# EAGLE schematic mpiovd (EAGLE 6.1), part 2 of 2
## Sheet 7 of 11: rel3
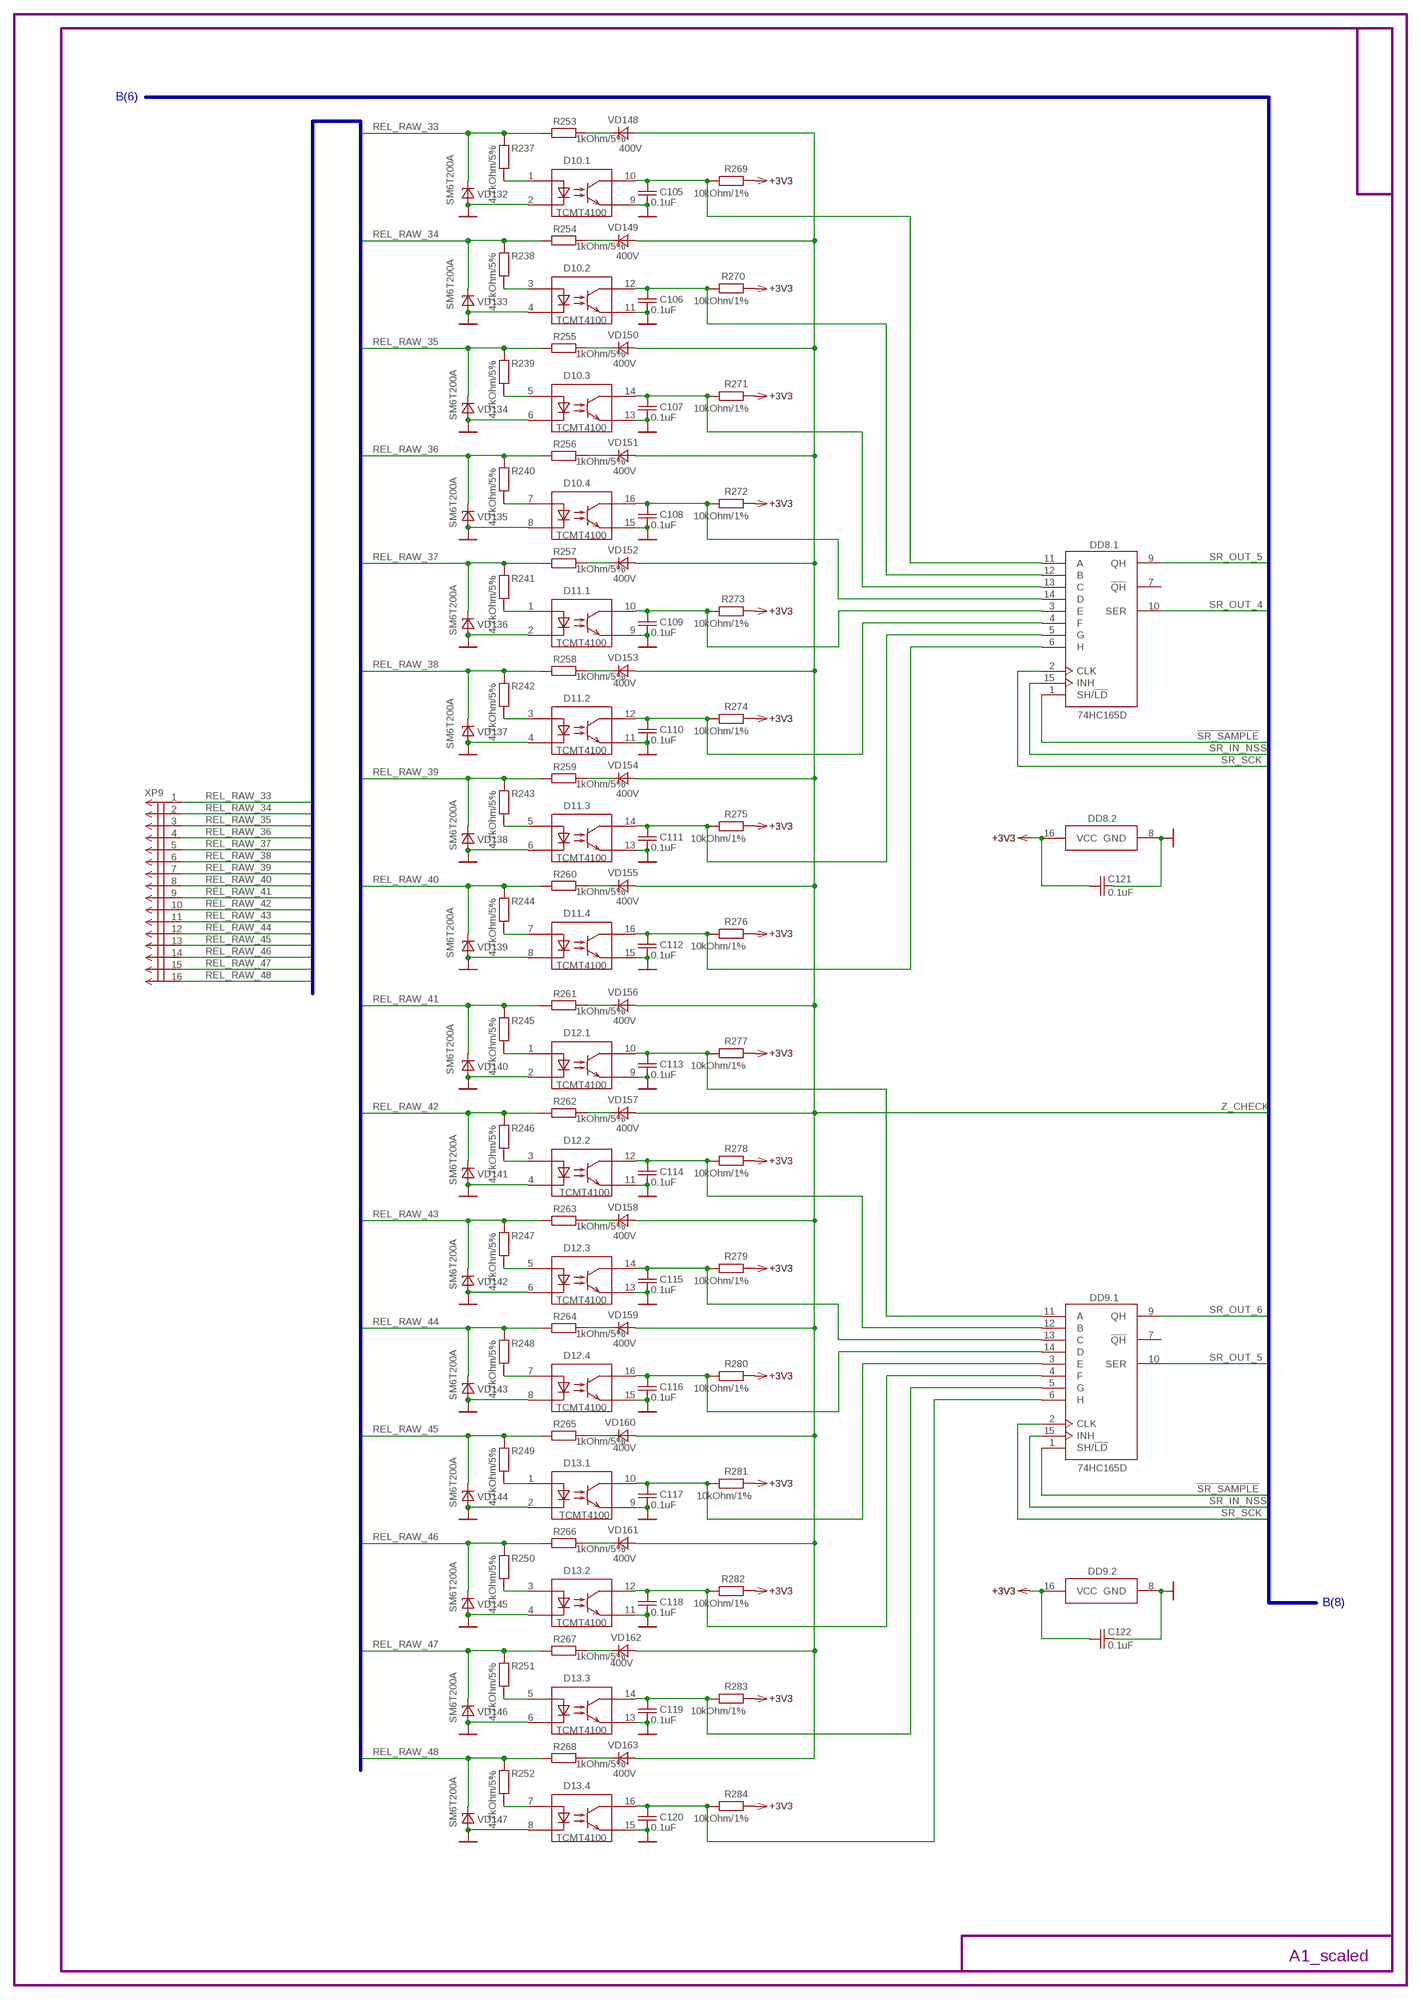
[diagram p6: schematic, sheet 7]

### Parts
C105  0.1uF  C-EUC0603  [C0603]
C106  0.1uF  C-EUC0603  [C0603]
C107  0.1uF  C-EUC0603  [C0603]
C108  0.1uF  C-EUC0603  [C0603]
C109  0.1uF  C-EUC0603  [C0603]
C110  0.1uF  C-EUC0603  [C0603]
C111  0.1uF  C-EUC0603  [C0603]
C112  0.1uF  C-EUC0603  [C0603]
C113  0.1uF  C-EUC0603  [C0603]
C114  0.1uF  C-EUC0603  [C0603]
C115  0.1uF  C-EUC0603  [C0603]
C116  0.1uF  C-EUC0603  [C0603]
C117  0.1uF  C-EUC0603  [C0603]
C118  0.1uF  C-EUC0603  [C0603]
C119  0.1uF  C-EUC0603  [C0603]
C120  0.1uF  C-EUC0603  [C0603]
C121  0.1uF  C-EUC0603  [C0603]
C122  0.1uF  C-EUC0603  [C0603]
D10  TCMT4100  [SO16]
D11  TCMT4100  [SO16]
D12  TCMT4100  [SO16]
D13  TCMT4100  [SO16]
DD8  74HC165D  [SO16]
DD9  74HC165D  [SO16]
R237  4.7kOhm/5%  R-EU_R1206  [R1206]
R238  4.7kOhm/5%  R-EU_R1206  [R1206]
R239  4.7kOhm/5%  R-EU_R1206  [R1206]
R240  4.7kOhm/5%  R-EU_R1206  [R1206]
R241  4.7kOhm/5%  R-EU_R1206  [R1206]
R242  4.7kOhm/5%  R-EU_R1206  [R1206]
R243  4.7kOhm/5%  R-EU_R1206  [R1206]
R244  4.7kOhm/5%  R-EU_R1206  [R1206]
R245  4.7kOhm/5%  R-EU_R1206  [R1206]
R246  4.7kOhm/5%  R-EU_R1206  [R1206]
R247  4.7kOhm/5%  R-EU_R1206  [R1206]
R248  4.7kOhm/5%  R-EU_R1206  [R1206]
R249  4.7kOhm/5%  R-EU_R1206  [R1206]
R250  4.7kOhm/5%  R-EU_R1206  [R1206]
R251  4.7kOhm/5%  R-EU_R1206  [R1206]
R252  4.7kOhm/5%  R-EU_R1206  [R1206]
R253  1kOhm/5%  R-EU_R2512  [R2512]
R254  1kOhm/5%  R-EU_R2512  [R2512]
R255  1kOhm/5%  R-EU_R2512  [R2512]
R256  1kOhm/5%  R-EU_R2512  [R2512]
R257  1kOhm/5%  R-EU_R2512  [R2512]
R258  1kOhm/5%  R-EU_R2512  [R2512]
R259  1kOhm/5%  R-EU_R2512  [R2512]
R260  1kOhm/5%  R-EU_R2512  [R2512]
R261  1kOhm/5%  R-EU_R2512  [R2512]
R262  1kOhm/5%  R-EU_R2512  [R2512]
R263  1kOhm/5%  R-EU_R2512  [R2512]
R264  1kOhm/5%  R-EU_R2512  [R2512]
R265  1kOhm/5%  R-EU_R2512  [R2512]
R266  1kOhm/5%  R-EU_R2512  [R2512]
R267  1kOhm/5%  R-EU_R2512  [R2512]
R268  1kOhm/5%  R-EU_R2512  [R2512]
R269  10kOhm/1%  R-EU_R0603  [R0603]
R270  10kOhm/1%  R-EU_R0603  [R0603]
R271  10kOhm/1%  R-EU_R0603  [R0603]
R272  10kOhm/1%  R-EU_R0603  [R0603]
R273  10kOhm/1%  R-EU_R0603  [R0603]
R274  10kOhm/1%  R-EU_R0603  [R0603]
R275  10kOhm/1%  R-EU_R0603  [R0603]
R276  10kOhm/1%  R-EU_R0603  [R0603]
R277  10kOhm/1%  R-EU_R0603  [R0603]
R278  10kOhm/1%  R-EU_R0603  [R0603]
R279  10kOhm/1%  R-EU_R0603  [R0603]
R280  10kOhm/1%  R-EU_R0603  [R0603]
R281  10kOhm/1%  R-EU_R0603  [R0603]
R282  10kOhm/1%  R-EU_R0603  [R0603]
R283  10kOhm/1%  R-EU_R0603  [R0603]
R284  10kOhm/1%  R-EU_R0603  [R0603]
VD132  SM6T200A  DIODE-TVS-UNIDIR-SMB  [SMB]
VD133  SM6T200A  DIODE-TVS-UNIDIR-SMB  [SMB]
VD134  SM6T200A  DIODE-TVS-UNIDIR-SMB  [SMB]
VD135  SM6T200A  DIODE-TVS-UNIDIR-SMB  [SMB]
VD136  SM6T200A  DIODE-TVS-UNIDIR-SMB  [SMB]
VD137  SM6T200A  DIODE-TVS-UNIDIR-SMB  [SMB]
VD138  SM6T200A  DIODE-TVS-UNIDIR-SMB  [SMB]
VD139  SM6T200A  DIODE-TVS-UNIDIR-SMB  [SMB]
VD140  SM6T200A  DIODE-TVS-UNIDIR-SMB  [SMB]
VD141  SM6T200A  DIODE-TVS-UNIDIR-SMB  [SMB]
VD142  SM6T200A  DIODE-TVS-UNIDIR-SMB  [SMB]
VD143  SM6T200A  DIODE-TVS-UNIDIR-SMB  [SMB]
VD144  SM6T200A  DIODE-TVS-UNIDIR-SMB  [SMB]
VD145  SM6T200A  DIODE-TVS-UNIDIR-SMB  [SMB]
VD146  SM6T200A  DIODE-TVS-UNIDIR-SMB  [SMB]
VD147  SM6T200A  DIODE-TVS-UNIDIR-SMB  [SMB]
VD148  400V  DIODE-STANDARD-SMA  [SMA]
VD149  400V  DIODE-STANDARD-SMA  [SMA]
VD150  400V  DIODE-STANDARD-SMA  [SMA]
VD151  400V  DIODE-STANDARD-SMA  [SMA]
VD152  400V  DIODE-STANDARD-SMA  [SMA]
VD153  400V  DIODE-STANDARD-SMA  [SMA]
VD154  400V  DIODE-STANDARD-SMA  [SMA]
VD155  400V  DIODE-STANDARD-SMA  [SMA]
VD156  400V  DIODE-STANDARD-SMA  [SMA]
VD157  400V  DIODE-STANDARD-SMA  [SMA]
VD158  400V  DIODE-STANDARD-SMA  [SMA]
VD159  400V  DIODE-STANDARD-SMA  [SMA]
VD160  400V  DIODE-STANDARD-SMA  [SMA]
VD161  400V  DIODE-STANDARD-SMA  [SMA]
VD162  400V  DIODE-STANDARD-SMA  [SMA]
VD163  400V  DIODE-STANDARD-SMA  [SMA]
XP9  MOLEX-90130-16  [MOLEX-90130-16]

### Nets
!SR_SAMPLE: DD8.1(.1:SH/!LD) DD9.1(.1:SH/!LD) ; also sheet 1,5,6,8
+3V3: C121.1 C122.1 DD8.16(.2:VCC) DD9.16(.2:VCC) R269.1 R270.1 R271.1 R272.1 R273.1 R274.1 R275.1 R276.1 R277.1 R278.1 R279.1 R280.1 R281.1 R282.1 R283.1 R284.1 ; also sheet 1,4,5,6,8,9,10
DISCRETE_33: C105.1 D10.10(.1:TC) DD8.11(.1:A) R269.2
DISCRETE_34: C106.1 D10.12(.2:TC) DD8.12(.1:B) R270.2
DISCRETE_35: C107.1 D10.14(.3:TC) DD8.13(.1:C) R271.2
DISCRETE_36: C108.1 D10.16(.4:TC) DD8.14(.1:D) R272.2
DISCRETE_37: C109.1 D11.10(.1:TC) DD8.3(.1:E) R273.2
DISCRETE_38: C110.1 D11.12(.2:TC) DD8.4(.1:F) R274.2
DISCRETE_39: C111.1 D11.14(.3:TC) DD8.5(.1:G) R275.2
DISCRETE_40: C112.1 D11.16(.4:TC) DD8.6(.1:H) R276.2
DISCRETE_41: C113.1 D12.10(.1:TC) DD9.11(.1:A) R277.2
DISCRETE_42: C114.1 D12.12(.2:TC) DD9.12(.1:B) R278.2
DISCRETE_43: C115.1 D12.14(.3:TC) DD9.13(.1:C) R279.2
DISCRETE_44: C116.1 D12.16(.4:TC) DD9.14(.1:D) R280.2
DISCRETE_45: C117.1 D13.10(.1:TC) DD9.3(.1:E) R281.2
DISCRETE_46: C118.1 D13.12(.2:TC) DD9.4(.1:F) R282.2
DISCRETE_47: C119.1 D13.14(.3:TC) DD9.5(.1:G) R283.2
DISCRETE_48: C120.1 D13.16(.4:TC) DD9.6(.1:H) R284.2
GND: C105.2 C106.2 C107.2 C108.2 C109.2 C110.2 C111.2 C112.2 C113.2 C114.2 C115.2 C116.2 C117.2 C118.2 C119.2 C120.2 C121.2 C122.2 D10.2(.1:DC) D10.4(.2:DC) D10.6(.3:DC) D10.8(.4:DC) D10.9(.1:TE) D10.11(.2:TE) D10.13(.3:TE) D10.15(.4:TE) D11.2(.1:DC) D11.4(.2:DC) D11.6(.3:DC) D11.8(.4:DC) D11.9(.1:TE) D11.11(.2:TE) D11.13(.3:TE) D11.15(.4:TE) D12.2(.1:DC) D12.4(.2:DC) D12.6(.3:DC) D12.8(.4:DC) D12.9(.1:TE) D12.11(.2:TE) D12.13(.3:TE) D12.15(.4:TE) D13.2(.1:DC) D13.4(.2:DC) D13.6(.3:DC) D13.8(.4:DC) D13.9(.1:TE) D13.11(.2:TE) D13.13(.3:TE) D13.15(.4:TE) DD8.8(.2:GND) DD9.8(.2:GND) VD132.A VD133.A VD134.A VD135.A VD136.A VD137.A VD138.A VD139.A VD140.A VD141.A VD142.A VD143.A VD144.A VD145.A VD146.A VD147.A ; also sheet 1,2,3,4,5,6,8,9,10
N$91: D10.1(.1:DA) R237.2
N$93: D10.3(.2:DA) R238.2
N$94: D10.5(.3:DA) R239.2
N$95: D10.7(.4:DA) R240.2
N$96: R253.2 VD148.C
N$97: D11.1(.1:DA) R241.2
N$98: D11.3(.2:DA) R242.2
N$99: D11.5(.3:DA) R243.2
N$100: D11.7(.4:DA) R244.2
N$101: D12.1(.1:DA) R245.2
N$102: D12.3(.2:DA) R246.2
N$103: D12.5(.3:DA) R247.2
N$104: D12.7(.4:DA) R248.2
N$105: D13.1(.1:DA) R249.2
N$106: D13.3(.2:DA) R250.2
N$107: D13.5(.3:DA) R251.2
N$108: D13.7(.4:DA) R252.2
N$109: R254.2 VD149.C
N$111: R255.2 VD150.C
N$113: R256.2 VD151.C
N$115: R257.2 VD152.C
N$117: R258.2 VD153.C
N$119: R259.2 VD154.C
N$121: R260.2 VD155.C
N$123: R261.2 VD156.C
N$125: R262.2 VD157.C
N$127: R263.2 VD158.C
N$129: R264.2 VD159.C
N$131: R265.2 VD160.C
N$133: R266.2 VD161.C
N$135: R267.2 VD162.C
N$137: R268.2 VD163.C
REL_RAW_33: R237.1 R253.1 VD132.C XP9.1
REL_RAW_34: R238.1 R254.1 VD133.C XP9.2
REL_RAW_35: R239.1 R255.1 VD134.C XP9.3
REL_RAW_36: R240.1 R256.1 VD135.C XP9.4
REL_RAW_37: R241.1 R257.1 VD136.C XP9.5
REL_RAW_38: R242.1 R258.1 VD137.C XP9.6
REL_RAW_39: R243.1 R259.1 VD138.C XP9.7
REL_RAW_40: R244.1 R260.1 VD139.C XP9.8
REL_RAW_41: R245.1 R261.1 VD140.C XP9.9
REL_RAW_42: R246.1 R262.1 VD141.C XP9.10
REL_RAW_43: R247.1 R263.1 VD142.C XP9.11
REL_RAW_44: R248.1 R264.1 VD143.C XP9.12
REL_RAW_45: R249.1 R265.1 VD144.C XP9.13
REL_RAW_46: R250.1 R266.1 VD145.C XP9.14
REL_RAW_47: R251.1 R267.1 VD146.C XP9.15
REL_RAW_48: R252.1 R268.1 VD147.C XP9.16
SR_IN_NSS: DD8.15(.1:INH) DD9.15(.1:INH) ; also sheet 1,5,6,8
SR_OUT_4: DD8.10(.1:SER) ; also sheet 6
SR_OUT_5: DD8.9(.1:QH) DD9.10(.1:SER)
SR_OUT_6: DD9.9(.1:QH) ; also sheet 8
SR_SCK: DD8.2(.1:CLK) DD9.2(.1:CLK) ; also sheet 1,5,6,8,9
Z_CHECK: VD148.A VD149.A VD150.A VD151.A VD152.A VD153.A VD154.A VD155.A VD156.A VD157.A VD158.A VD159.A VD160.A VD161.A VD162.A VD163.A ; also sheet 5,6,8
Unconnected: DD8.7(.1:!QH) DD9.7(.1:!QH)

### Buses
IO_EXPAND:SR_MISO,SR_MOSI,SR_SCK,!SR_SAMPLE,SR_IN_NSS,SR_OUT_NSS,!SR_OUT_ENABLE,SR_OUT_[1..7],Z_CHECK_TOGGLE,Z_CHECK
REL_RAW_[1..64]

### Notes on the sheet
- B(6)
- B(8)

## Sheet 8 of 11: rel4
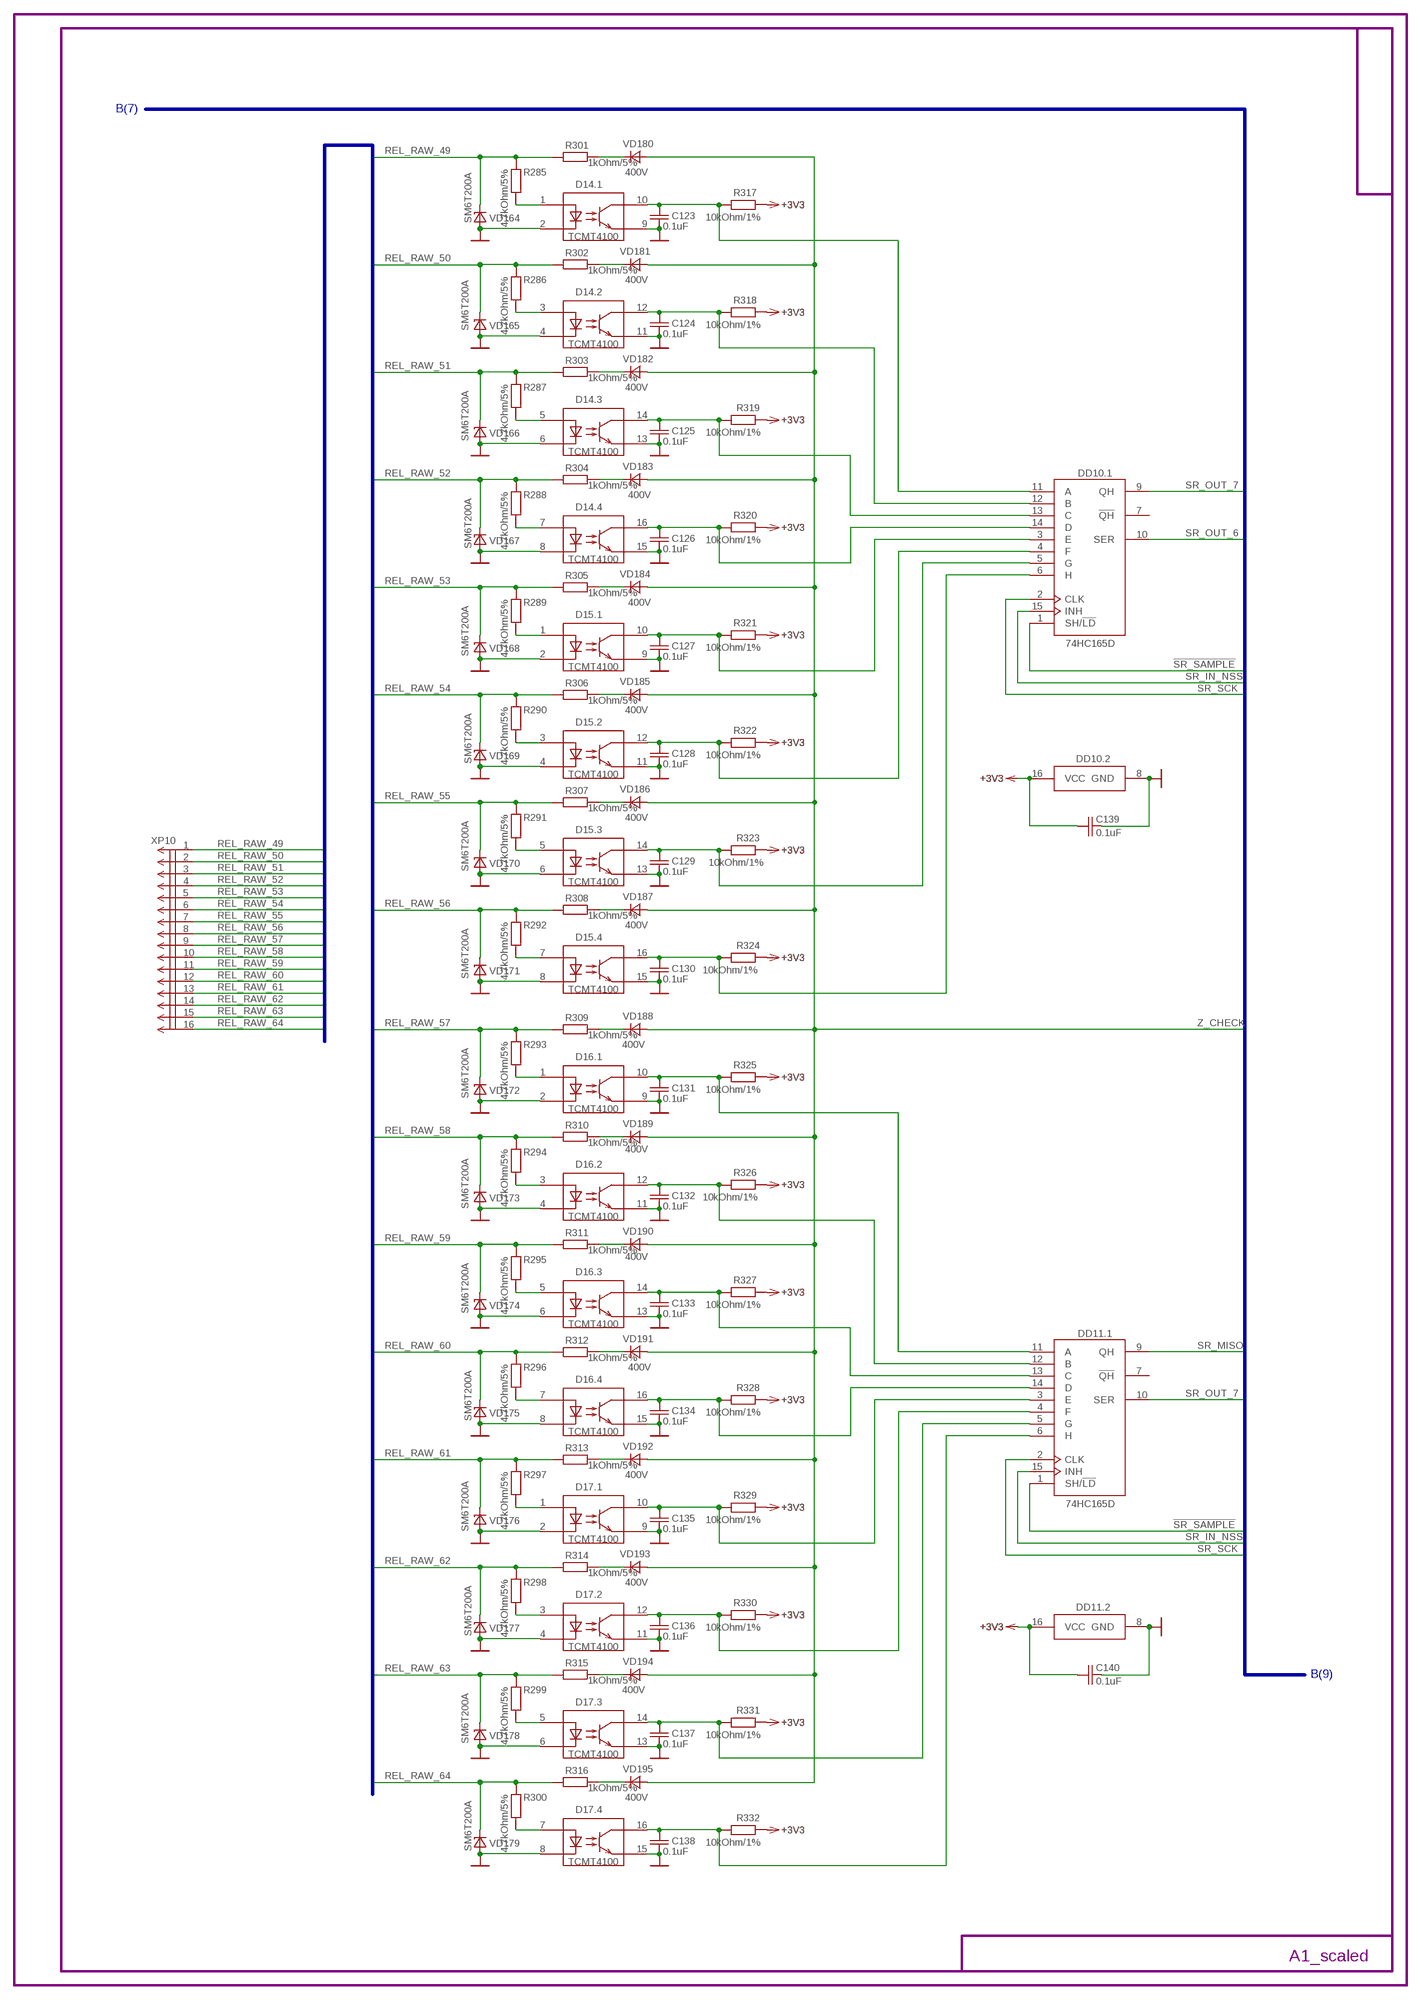
[diagram p7: schematic, sheet 8]

### Parts
C123  0.1uF  C-EUC0603  [C0603]
C124  0.1uF  C-EUC0603  [C0603]
C125  0.1uF  C-EUC0603  [C0603]
C126  0.1uF  C-EUC0603  [C0603]
C127  0.1uF  C-EUC0603  [C0603]
C128  0.1uF  C-EUC0603  [C0603]
C129  0.1uF  C-EUC0603  [C0603]
C130  0.1uF  C-EUC0603  [C0603]
C131  0.1uF  C-EUC0603  [C0603]
C132  0.1uF  C-EUC0603  [C0603]
C133  0.1uF  C-EUC0603  [C0603]
C134  0.1uF  C-EUC0603  [C0603]
C135  0.1uF  C-EUC0603  [C0603]
C136  0.1uF  C-EUC0603  [C0603]
C137  0.1uF  C-EUC0603  [C0603]
C138  0.1uF  C-EUC0603  [C0603]
C139  0.1uF  C-EUC0603  [C0603]
C140  0.1uF  C-EUC0603  [C0603]
D14  TCMT4100  [SO16]
D15  TCMT4100  [SO16]
D16  TCMT4100  [SO16]
D17  TCMT4100  [SO16]
DD10  74HC165D  [SO16]
DD11  74HC165D  [SO16]
R285  4.7kOhm/5%  R-EU_R1206  [R1206]
R286  4.7kOhm/5%  R-EU_R1206  [R1206]
R287  4.7kOhm/5%  R-EU_R1206  [R1206]
R288  4.7kOhm/5%  R-EU_R1206  [R1206]
R289  4.7kOhm/5%  R-EU_R1206  [R1206]
R290  4.7kOhm/5%  R-EU_R1206  [R1206]
R291  4.7kOhm/5%  R-EU_R1206  [R1206]
R292  4.7kOhm/5%  R-EU_R1206  [R1206]
R293  4.7kOhm/5%  R-EU_R1206  [R1206]
R294  4.7kOhm/5%  R-EU_R1206  [R1206]
R295  4.7kOhm/5%  R-EU_R1206  [R1206]
R296  4.7kOhm/5%  R-EU_R1206  [R1206]
R297  4.7kOhm/5%  R-EU_R1206  [R1206]
R298  4.7kOhm/5%  R-EU_R1206  [R1206]
R299  4.7kOhm/5%  R-EU_R1206  [R1206]
R300  4.7kOhm/5%  R-EU_R1206  [R1206]
R301  1kOhm/5%  R-EU_R2512  [R2512]
R302  1kOhm/5%  R-EU_R2512  [R2512]
R303  1kOhm/5%  R-EU_R2512  [R2512]
R304  1kOhm/5%  R-EU_R2512  [R2512]
R305  1kOhm/5%  R-EU_R2512  [R2512]
R306  1kOhm/5%  R-EU_R2512  [R2512]
R307  1kOhm/5%  R-EU_R2512  [R2512]
R308  1kOhm/5%  R-EU_R2512  [R2512]
R309  1kOhm/5%  R-EU_R2512  [R2512]
R310  1kOhm/5%  R-EU_R2512  [R2512]
R311  1kOhm/5%  R-EU_R2512  [R2512]
R312  1kOhm/5%  R-EU_R2512  [R2512]
R313  1kOhm/5%  R-EU_R2512  [R2512]
R314  1kOhm/5%  R-EU_R2512  [R2512]
R315  1kOhm/5%  R-EU_R2512  [R2512]
R316  1kOhm/5%  R-EU_R2512  [R2512]
R317  10kOhm/1%  R-EU_R0603  [R0603]
R318  10kOhm/1%  R-EU_R0603  [R0603]
R319  10kOhm/1%  R-EU_R0603  [R0603]
R320  10kOhm/1%  R-EU_R0603  [R0603]
R321  10kOhm/1%  R-EU_R0603  [R0603]
R322  10kOhm/1%  R-EU_R0603  [R0603]
R323  10kOhm/1%  R-EU_R0603  [R0603]
R324  10kOhm/1%  R-EU_R0603  [R0603]
R325  10kOhm/1%  R-EU_R0603  [R0603]
R326  10kOhm/1%  R-EU_R0603  [R0603]
R327  10kOhm/1%  R-EU_R0603  [R0603]
R328  10kOhm/1%  R-EU_R0603  [R0603]
R329  10kOhm/1%  R-EU_R0603  [R0603]
R330  10kOhm/1%  R-EU_R0603  [R0603]
R331  10kOhm/1%  R-EU_R0603  [R0603]
R332  10kOhm/1%  R-EU_R0603  [R0603]
VD164  SM6T200A  DIODE-TVS-UNIDIR-SMB  [SMB]
VD165  SM6T200A  DIODE-TVS-UNIDIR-SMB  [SMB]
VD166  SM6T200A  DIODE-TVS-UNIDIR-SMB  [SMB]
VD167  SM6T200A  DIODE-TVS-UNIDIR-SMB  [SMB]
VD168  SM6T200A  DIODE-TVS-UNIDIR-SMB  [SMB]
VD169  SM6T200A  DIODE-TVS-UNIDIR-SMB  [SMB]
VD170  SM6T200A  DIODE-TVS-UNIDIR-SMB  [SMB]
VD171  SM6T200A  DIODE-TVS-UNIDIR-SMB  [SMB]
VD172  SM6T200A  DIODE-TVS-UNIDIR-SMB  [SMB]
VD173  SM6T200A  DIODE-TVS-UNIDIR-SMB  [SMB]
VD174  SM6T200A  DIODE-TVS-UNIDIR-SMB  [SMB]
VD175  SM6T200A  DIODE-TVS-UNIDIR-SMB  [SMB]
VD176  SM6T200A  DIODE-TVS-UNIDIR-SMB  [SMB]
VD177  SM6T200A  DIODE-TVS-UNIDIR-SMB  [SMB]
VD178  SM6T200A  DIODE-TVS-UNIDIR-SMB  [SMB]
VD179  SM6T200A  DIODE-TVS-UNIDIR-SMB  [SMB]
VD180  400V  DIODE-STANDARD-SMA  [SMA]
VD181  400V  DIODE-STANDARD-SMA  [SMA]
VD182  400V  DIODE-STANDARD-SMA  [SMA]
VD183  400V  DIODE-STANDARD-SMA  [SMA]
VD184  400V  DIODE-STANDARD-SMA  [SMA]
VD185  400V  DIODE-STANDARD-SMA  [SMA]
VD186  400V  DIODE-STANDARD-SMA  [SMA]
VD187  400V  DIODE-STANDARD-SMA  [SMA]
VD188  400V  DIODE-STANDARD-SMA  [SMA]
VD189  400V  DIODE-STANDARD-SMA  [SMA]
VD190  400V  DIODE-STANDARD-SMA  [SMA]
VD191  400V  DIODE-STANDARD-SMA  [SMA]
VD192  400V  DIODE-STANDARD-SMA  [SMA]
VD193  400V  DIODE-STANDARD-SMA  [SMA]
VD194  400V  DIODE-STANDARD-SMA  [SMA]
VD195  400V  DIODE-STANDARD-SMA  [SMA]
XP10  MOLEX-90130-16  [MOLEX-90130-16]

### Nets
!SR_SAMPLE: DD10.1(.1:SH/!LD) DD11.1(.1:SH/!LD) ; also sheet 1,5,6,7
+3V3: C139.1 C140.1 DD10.16(.2:VCC) DD11.16(.2:VCC) R317.1 R318.1 R319.1 R320.1 R321.1 R322.1 R323.1 R324.1 R325.1 R326.1 R327.1 R328.1 R329.1 R330.1 R331.1 R332.1 ; also sheet 1,4,5,6,7,9,10
DISCRETE_49: C123.1 D14.10(.1:TC) DD10.11(.1:A) R317.2
DISCRETE_50: C124.1 D14.12(.2:TC) DD10.12(.1:B) R318.2
DISCRETE_51: C125.1 D14.14(.3:TC) DD10.13(.1:C) R319.2
DISCRETE_52: C126.1 D14.16(.4:TC) DD10.14(.1:D) R320.2
DISCRETE_53: C127.1 D15.10(.1:TC) DD10.3(.1:E) R321.2
DISCRETE_54: C128.1 D15.12(.2:TC) DD10.4(.1:F) R322.2
DISCRETE_55: C129.1 D15.14(.3:TC) DD10.5(.1:G) R323.2
DISCRETE_56: C130.1 D15.16(.4:TC) DD10.6(.1:H) R324.2
DISCRETE_57: C131.1 D16.10(.1:TC) DD11.11(.1:A) R325.2
DISCRETE_58: C132.1 D16.12(.2:TC) DD11.12(.1:B) R326.2
DISCRETE_59: C133.1 D16.14(.3:TC) DD11.13(.1:C) R327.2
DISCRETE_60: C134.1 D16.16(.4:TC) DD11.14(.1:D) R328.2
DISCRETE_61: C135.1 D17.10(.1:TC) DD11.3(.1:E) R329.2
DISCRETE_62: C136.1 D17.12(.2:TC) DD11.4(.1:F) R330.2
DISCRETE_63: C137.1 D17.14(.3:TC) DD11.5(.1:G) R331.2
DISCRETE_64: C138.1 D17.16(.4:TC) DD11.6(.1:H) R332.2
GND: C123.2 C124.2 C125.2 C126.2 C127.2 C128.2 C129.2 C130.2 C131.2 C132.2 C133.2 C134.2 C135.2 C136.2 C137.2 C138.2 C139.2 C140.2 D14.2(.1:DC) D14.4(.2:DC) D14.6(.3:DC) D14.8(.4:DC) D14.9(.1:TE) D14.11(.2:TE) D14.13(.3:TE) D14.15(.4:TE) D15.2(.1:DC) D15.4(.2:DC) D15.6(.3:DC) D15.8(.4:DC) D15.9(.1:TE) D15.11(.2:TE) D15.13(.3:TE) D15.15(.4:TE) D16.2(.1:DC) D16.4(.2:DC) D16.6(.3:DC) D16.8(.4:DC) D16.9(.1:TE) D16.11(.2:TE) D16.13(.3:TE) D16.15(.4:TE) D17.2(.1:DC) D17.4(.2:DC) D17.6(.3:DC) D17.8(.4:DC) D17.9(.1:TE) D17.11(.2:TE) D17.13(.3:TE) D17.15(.4:TE) DD10.8(.2:GND) DD11.8(.2:GND) VD164.A VD165.A VD166.A VD167.A VD168.A VD169.A VD170.A VD171.A VD172.A VD173.A VD174.A VD175.A VD176.A VD177.A VD178.A VD179.A ; also sheet 1,2,3,4,5,6,7,9,10
N$110: R301.2 VD180.C
N$112: R302.2 VD181.C
N$114: R303.2 VD182.C
N$116: R304.2 VD183.C
N$118: R305.2 VD184.C
N$120: R306.2 VD185.C
N$122: R307.2 VD186.C
N$124: R308.2 VD187.C
N$126: R309.2 VD188.C
N$128: R310.2 VD189.C
N$130: R311.2 VD190.C
N$132: R312.2 VD191.C
N$134: R313.2 VD192.C
N$136: R314.2 VD193.C
N$138: R315.2 VD194.C
N$139: R316.2 VD195.C
N$140: D14.1(.1:DA) R285.2
N$141: D14.3(.2:DA) R286.2
N$142: D14.5(.3:DA) R287.2
N$143: D14.7(.4:DA) R288.2
N$144: D15.1(.1:DA) R289.2
N$145: D15.3(.2:DA) R290.2
N$146: D15.5(.3:DA) R291.2
N$147: D15.7(.4:DA) R292.2
N$148: D16.1(.1:DA) R293.2
N$149: D16.3(.2:DA) R294.2
N$150: D16.5(.3:DA) R295.2
N$151: D16.7(.4:DA) R296.2
N$152: D17.1(.1:DA) R297.2
N$153: D17.3(.2:DA) R298.2
N$154: D17.5(.3:DA) R299.2
N$155: D17.7(.4:DA) R300.2
REL_RAW_49: R285.1 R301.1 VD164.C XP10.1
REL_RAW_50: R286.1 R302.1 VD165.C XP10.2
REL_RAW_51: R287.1 R303.1 VD166.C XP10.3
REL_RAW_52: R288.1 R304.1 VD167.C XP10.4
REL_RAW_53: R289.1 R305.1 VD168.C XP10.5
REL_RAW_54: R290.1 R306.1 VD169.C XP10.6
REL_RAW_55: R291.1 R307.1 VD170.C XP10.7
REL_RAW_56: R292.1 R308.1 VD171.C XP10.8
REL_RAW_57: R293.1 R309.1 VD172.C XP10.9
REL_RAW_58: R294.1 R310.1 VD173.C XP10.10
REL_RAW_59: R295.1 R311.1 VD174.C XP10.11
REL_RAW_60: R296.1 R312.1 VD175.C XP10.12
REL_RAW_61: R297.1 R313.1 VD176.C XP10.13
REL_RAW_62: R298.1 R314.1 VD177.C XP10.14
REL_RAW_63: R299.1 R315.1 VD178.C XP10.15
REL_RAW_64: R300.1 R316.1 VD179.C XP10.16
SR_IN_NSS: DD10.15(.1:INH) DD11.15(.1:INH) ; also sheet 1,5,6,7
SR_MISO: DD11.9(.1:QH) ; also sheet 1
SR_OUT_6: DD10.10(.1:SER) ; also sheet 7
SR_OUT_7: DD10.9(.1:QH) DD11.10(.1:SER)
SR_SCK: DD10.2(.1:CLK) DD11.2(.1:CLK) ; also sheet 1,5,6,7,9
Z_CHECK: VD180.A VD181.A VD182.A VD183.A VD184.A VD185.A VD186.A VD187.A VD188.A VD189.A VD190.A VD191.A VD192.A VD193.A VD194.A VD195.A ; also sheet 5,6,7
Unconnected: DD10.7(.1:!QH) DD11.7(.1:!QH)

### Buses
IO_EXPAND:SR_MISO,SR_MOSI,SR_SCK,!SR_SAMPLE,SR_IN_NSS,SR_OUT_NSS,!SR_OUT_ENABLE,SR_OUT_[1..7],Z_CHECK_TOGGLE,Z_CHECK
REL_RAW_[1..64]

### Notes on the sheet
- B(7)
- B(9)

## Sheet 9 of 11: Drivers
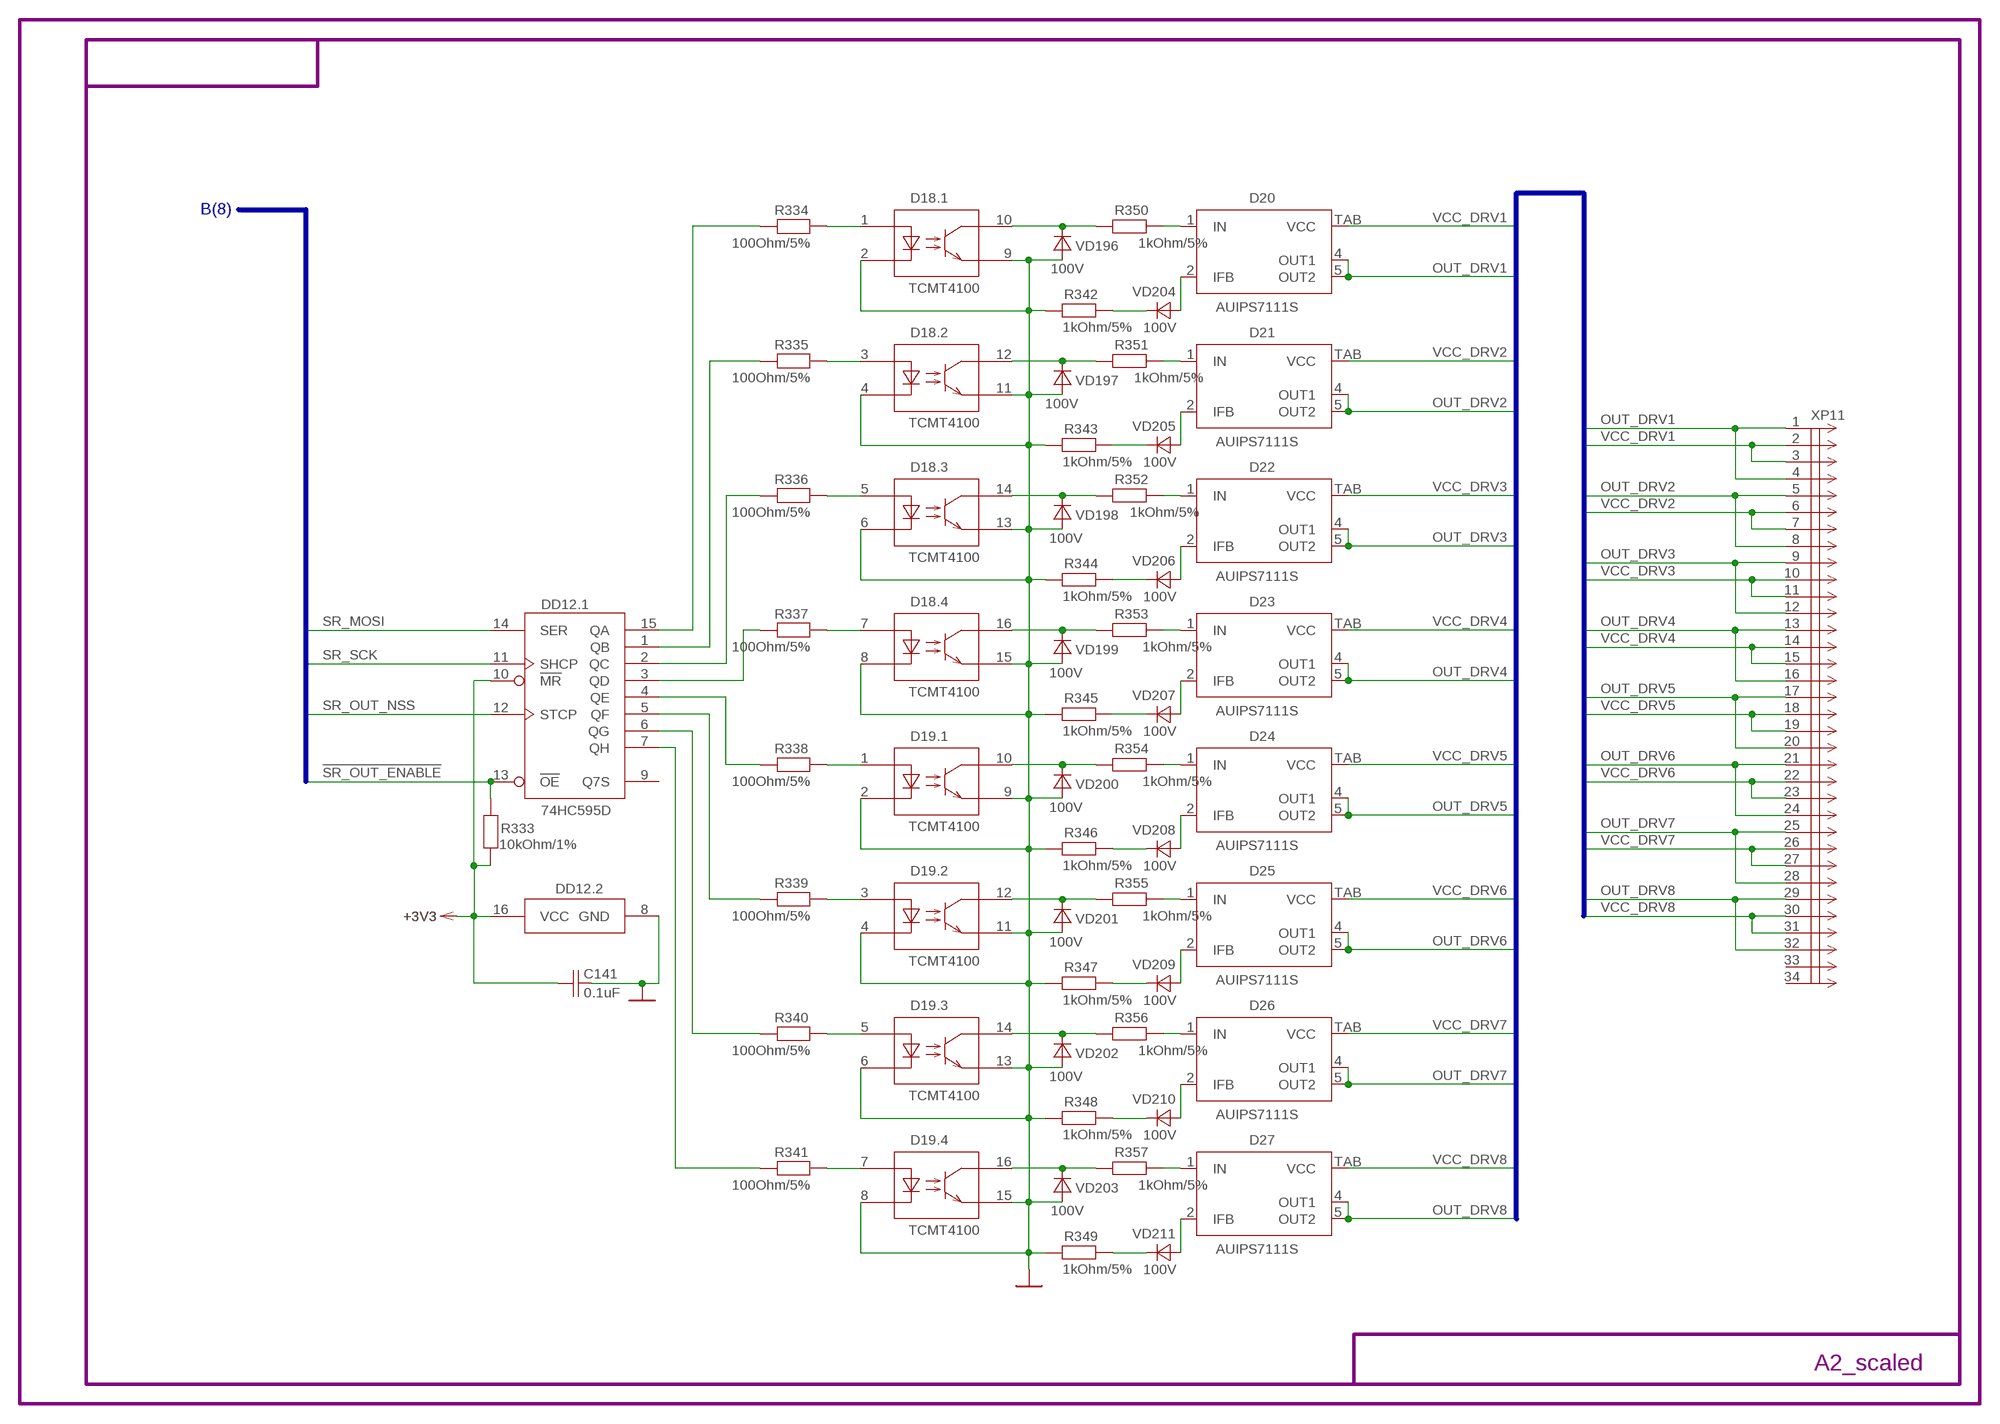
[diagram p8: schematic, sheet 9]

### Parts
C141  0.1uF  C-EUC0603  [C0603]
D18  TCMT4100  [SO16]
D19  TCMT4100  [SO16]
D20  AUIPS7111S  [TO252-5-11]
D21  AUIPS7111S  [TO252-5-11]
D22  AUIPS7111S  [TO252-5-11]
D23  AUIPS7111S  [TO252-5-11]
D24  AUIPS7111S  [TO252-5-11]
D25  AUIPS7111S  [TO252-5-11]
D26  AUIPS7111S  [TO252-5-11]
D27  AUIPS7111S  [TO252-5-11]
DD12  74HC595D  [SO16]
R333  10kOhm/1%  R-EU_R0603  [R0603]
R334  100Ohm/5%  R-EU_R0603  [R0603]
R335  100Ohm/5%  R-EU_R0603  [R0603]
R336  100Ohm/5%  R-EU_R0603  [R0603]
R337  100Ohm/5%  R-EU_R0603  [R0603]
R338  100Ohm/5%  R-EU_R0603  [R0603]
R339  100Ohm/5%  R-EU_R0603  [R0603]
R340  100Ohm/5%  R-EU_R0603  [R0603]
R341  100Ohm/5%  R-EU_R0603  [R0603]
R342  1kOhm/5%  R-EU_R0805  [R0805]
R343  1kOhm/5%  R-EU_R0805  [R0805]
R344  1kOhm/5%  R-EU_R0805  [R0805]
R345  1kOhm/5%  R-EU_R0805  [R0805]
R346  1kOhm/5%  R-EU_R0805  [R0805]
R347  1kOhm/5%  R-EU_R0805  [R0805]
R348  1kOhm/5%  R-EU_R0805  [R0805]
R349  1kOhm/5%  R-EU_R0805  [R0805]
R350  1kOhm/5%  R-EU_R0805  [R0805]
R351  1kOhm/5%  R-EU_R0805  [R0805]
R352  1kOhm/5%  R-EU_R0805  [R0805]
R353  1kOhm/5%  R-EU_R0805  [R0805]
R354  1kOhm/5%  R-EU_R0805  [R0805]
R355  1kOhm/5%  R-EU_R0805  [R0805]
R356  1kOhm/5%  R-EU_R0805  [R0805]
R357  1kOhm/5%  R-EU_R0805  [R0805]
VD196  100V  DIODE-STANDARD-SOD323  [SOD323]
VD197  100V  DIODE-STANDARD-SOD323  [SOD323]
VD198  100V  DIODE-STANDARD-SOD323  [SOD323]
VD199  100V  DIODE-STANDARD-SOD323  [SOD323]
VD200  100V  DIODE-STANDARD-SOD323  [SOD323]
VD201  100V  DIODE-STANDARD-SOD323  [SOD323]
VD202  100V  DIODE-STANDARD-SOD323  [SOD323]
VD203  100V  DIODE-STANDARD-SOD323  [SOD323]
VD204  100V  DIODE-STANDARD-SOD323  [SOD323]
VD205  100V  DIODE-STANDARD-SOD323  [SOD323]
VD206  100V  DIODE-STANDARD-SOD323  [SOD323]
VD207  100V  DIODE-STANDARD-SOD323  [SOD323]
VD208  100V  DIODE-STANDARD-SOD323  [SOD323]
VD209  100V  DIODE-STANDARD-SOD323  [SOD323]
VD210  100V  DIODE-STANDARD-SOD323  [SOD323]
VD211  100V  DIODE-STANDARD-SOD323  [SOD323]
XP11  MOLEX-90130-34  [MOLEX-90130-34]

### Nets
!SR_OUT_ENABLE: DD12.13(.1:!OE) R333.1 ; also sheet 1
+3V3: C141.1 DD12.10(.1:!MR) DD12.16(.2:VCC) R333.2 ; also sheet 1,4,5,6,7,8,10
GND: C141.2 D18.2(.1:DC) D18.4(.2:DC) D18.6(.3:DC) D18.8(.4:DC) D18.9(.1:TE) D18.11(.2:TE) D18.13(.3:TE) D18.15(.4:TE) D19.2(.1:DC) D19.4(.2:DC) D19.6(.3:DC) D19.8(.4:DC) D19.9(.1:TE) D19.11(.2:TE) D19.13(.3:TE) D19.15(.4:TE) DD12.8(.2:GND) R342.1 R343.1 R344.1 R345.1 R346.1 R347.1 R348.1 R349.1 VD196.A VD197.A VD198.A VD199.A VD200.A VD201.A VD202.A VD203.A ; also sheet 1,2,3,4,5,6,7,8,10
N$1: D27.1(IN) R357.2
N$3: D26.1(IN) R356.2
N$4: D25.1(IN) R355.2
N$5: D24.1(IN) R354.2
N$6: D23.1(IN) R353.2
N$8: D22.1(IN) R352.2
N$9: D21.1(IN) R351.2
N$10: D20.1(IN) R350.2
N$11: D19.7(.4:DA) R341.1
N$46: D18.10(.1:TC) R350.1 VD196.C
N$47: D18.12(.2:TC) R351.1 VD197.C
N$48: D18.14(.3:TC) R352.1 VD198.C
N$49: D18.16(.4:TC) R353.1 VD199.C
N$50: D19.10(.1:TC) R354.1 VD200.C
N$51: D19.12(.2:TC) R355.1 VD201.C
N$52: D19.14(.3:TC) R356.1 VD202.C
N$53: D19.16(.4:TC) R357.1 VD203.C
N$54: D19.5(.3:DA) R340.1
N$55: D19.3(.2:DA) R339.1
N$56: D19.1(.1:DA) R338.1
N$57: D18.7(.4:DA) R337.1
N$58: D18.5(.3:DA) R336.1
N$59: D18.3(.2:DA) R335.1
N$60: D18.1(.1:DA) R334.1
N$61: DD12.15(.1:QA) R334.2
N$62: D20.2(IFB) VD204.A
N$63: D21.2(IFB) VD205.A
N$64: D22.2(IFB) VD206.A
N$65: D23.2(IFB) VD207.A
N$66: D24.2(IFB) VD208.A
N$67: D25.2(IFB) VD209.A
N$68: D26.2(IFB) VD210.A
N$69: D27.2(IFB) VD211.A
N$70: DD12.1(.1:QB) R335.2
N$71: DD12.2(.1:QC) R336.2
N$72: DD12.7(.1:QH) R341.2
N$73: DD12.6(.1:QG) R340.2
N$74: DD12.5(.1:QF) R339.2
N$75: R342.2 VD204.C
N$76: R343.2 VD205.C
N$77: R344.2 VD206.C
N$78: R345.2 VD207.C
N$79: R346.2 VD208.C
N$80: DD12.3(.1:QD) R337.2
N$81: DD12.4(.1:QE) R338.2
N$82: R347.2 VD209.C
N$83: R348.2 VD210.C
N$84: R349.2 VD211.C
OUT_DRV1: D20.4(OUT1) D20.5(OUT2) XP11.1 XP11.4
OUT_DRV2: D21.4(OUT1) D21.5(OUT2) XP11.5 XP11.8
OUT_DRV3: D22.4(OUT1) D22.5(OUT2) XP11.9 XP11.12
OUT_DRV4: D23.4(OUT1) D23.5(OUT2) XP11.13 XP11.16
OUT_DRV5: D24.4(OUT1) D24.5(OUT2) XP11.17 XP11.20
OUT_DRV6: D25.4(OUT1) D25.5(OUT2) XP11.21 XP11.24
OUT_DRV7: D26.4(OUT1) D26.5(OUT2) XP11.25 XP11.28
OUT_DRV8: D27.4(OUT1) D27.5(OUT2) XP11.29 XP11.32
SR_MOSI: DD12.14(.1:SER) ; also sheet 1
SR_OUT_NSS: DD12.12(.1:STCP) ; also sheet 1
SR_SCK: DD12.11(.1:SHCP) ; also sheet 1,5,6,7,8
VCC_DRV1: D20.TAB(VCC) XP11.2 XP11.3
VCC_DRV2: D21.TAB(VCC) XP11.6 XP11.7
VCC_DRV3: D22.TAB(VCC) XP11.10 XP11.11
VCC_DRV4: D23.TAB(VCC) XP11.14 XP11.15
VCC_DRV5: D24.TAB(VCC) XP11.18 XP11.19
VCC_DRV6: D25.TAB(VCC) XP11.22 XP11.23
VCC_DRV7: D26.TAB(VCC) XP11.26 XP11.27
VCC_DRV8: D27.TAB(VCC) XP11.30 XP11.31
Unconnected: DD12.9(.1:Q7S) XP11.33 XP11.34

### Buses
IO_EXPAND:SR_MISO,SR_MOSI,SR_SCK,!SR_SAMPLE,SR_IN_NSS,SR_OUT_NSS,!SR_OUT_ENABLE,SR_OUT_[1..7],Z_CHECK_TOGGLE,Z_CHECK
VCC_DRV[1..8],OUT_DRV[1..8]

### Notes on the sheet
- B(8)

## Sheet 10 of 11: Interfaces
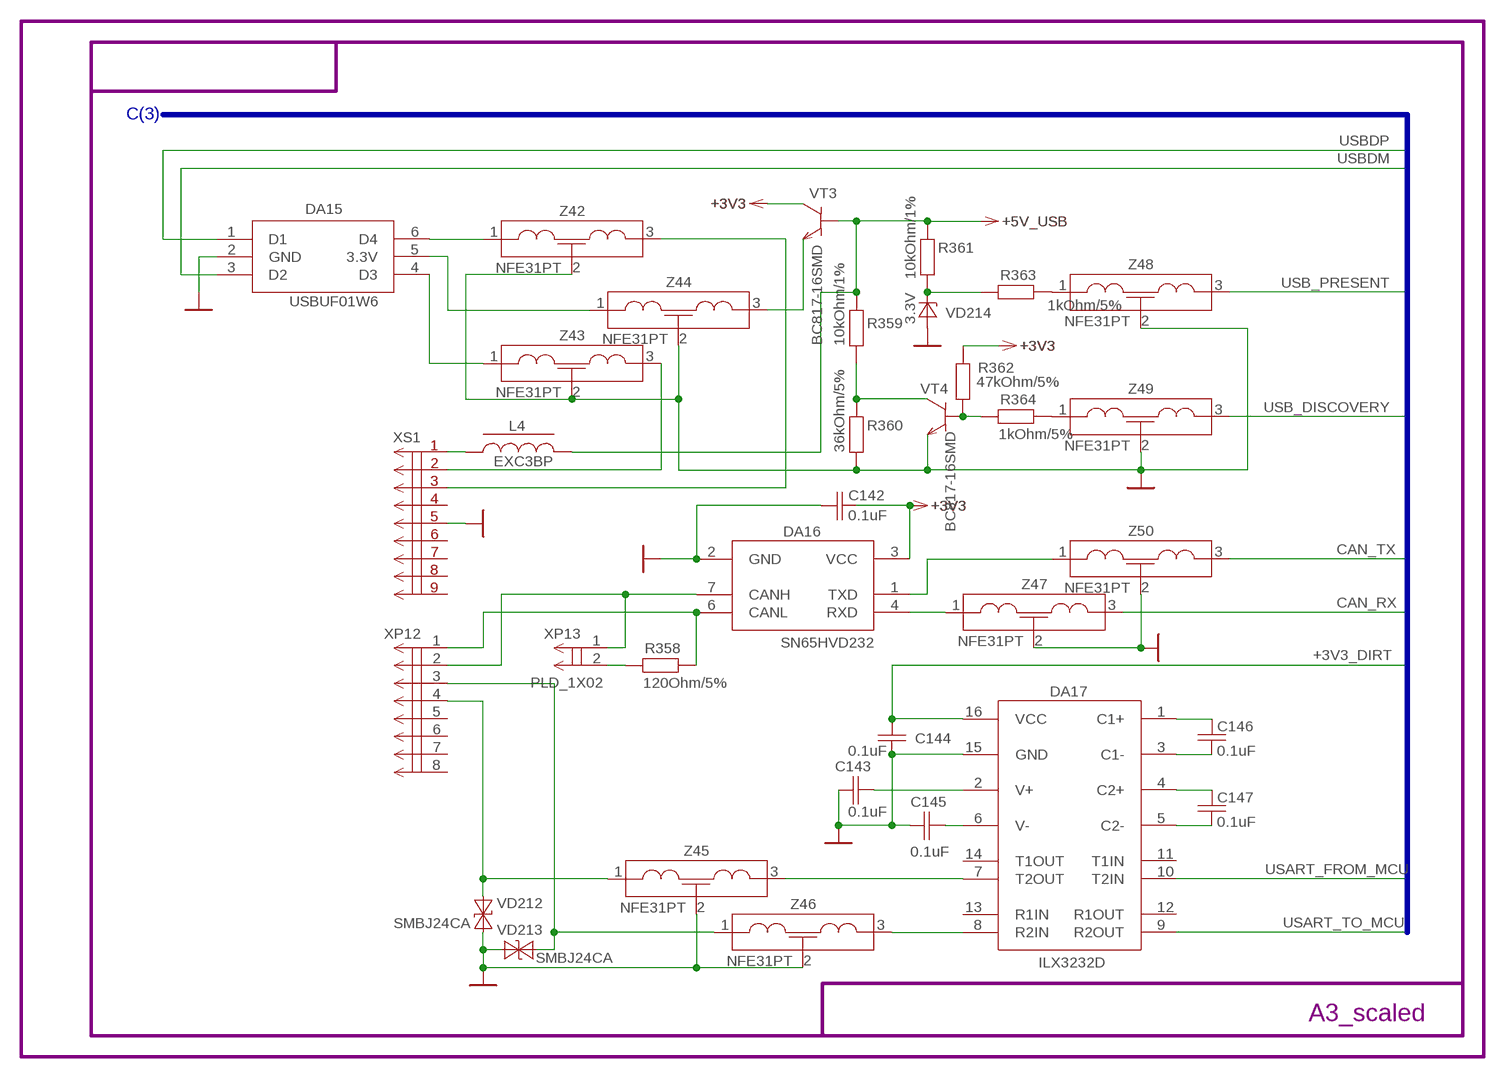
[diagram p9: schematic, sheet 10]

### Parts
C142  0.1uF  C-EUC0603  [C0603]
C143  0.1uF  C-EUC0603  [C0603]
C144  0.1uF  C-EUC0603  [C0603]
C145  0.1uF  C-EUC0603  [C0603]
C146  0.1uF  C-EUC0603  [C0603]
C147  0.1uF  C-EUC0603  [C0603]
DA15  USBUF01W6  [SOTT323-6L]
DA16  SN65HVD232  [SO08]
DA17  ILX3232D  [SO16]
L4  EXC3BP  [L0603]
R358  120Ohm/5%  R-EU_R1206  [R1206]
R359  10kOhm/1%  R-EU_R0603  [R0603]
R360  36kOhm/5%  R-EU_R0603  [R0603]
R361  10kOhm/1%  R-EU_R0603  [R0603]
R362  47kOhm/5%  R-EU_R0603  [R0603]
R363  1kOhm/5%  R-EU_R0805  [R0805]
R364  1kOhm/5%  R-EU_R0805  [R0805]
VD212  SMBJ24CA  DIODE-TVS-BIDIR-SMB  [SMB-BIDIR]
VD213  SMBJ24CA  DIODE-TVS-BIDIR-SMB  [SMB-BIDIR]
VD214  3.3V  DIODE-ZENER-  [SOD80]
VT3  BC817-16SMD  [SOT23-BEC]
VT4  BC817-16SMD  [SOT23-BEC]
XP12  MOLEX-90130-08  [MOLEX-90130-08]
XP13  PLD_1X02  [PLD_1X02]
XS1  USB-MINIB_(SOVOK-UGO)  [USB-MINIB]
Z42  NFE31PT  [NFE31]
Z43  NFE31PT  [NFE31]
Z44  NFE31PT  [NFE31]
Z45  NFE31PT  [NFE31]
Z46  NFE31PT  [NFE31]
Z47  NFE31PT  [NFE31]
Z48  NFE31PT  [NFE31]
Z49  NFE31PT  [NFE31]
Z50  NFE31PT  [NFE31]

### Nets
+3V3: C142.2 DA16.3(VCC) R362.2 VT3.C ; also sheet 1,4,5,6,7,8,9
+3V3_DIRT: C144.1 DA17.16(VCC) ; also sheet 1
+5V_USB: L4.2 R359.2 R361.2 VT3.B ; also sheet 4
CAN_RX: Z47.3 ; also sheet 1
CAN_TX: Z50.3 ; also sheet 1
CANH: DA16.7(CANH) XP12.2 XP13.1
CANL: DA16.6(CANL) R358.2 XP12.1
D+: XS1.D+ Z42.3
D-: XS1.D- Z43.3
FROM_RS232: VD213.A2 XP12.3 Z46.1
GND: C142.1 C143.2 C144.2 C145.2 DA15.2(GND) DA16.2(GND) DA17.15(GND) R360.1 VD212.A1 VD213.A1 VD214.A VT4.E XS1.GND Z42.2 Z43.2 Z44.2 Z45.2 Z46.2 Z47.2 Z48.2 Z49.2 Z50.2 ; also sheet 1,2,3,4,5,6,7,8,9
N$224: R358.1 XP13.2
N$227: R362.1 R364.1 VT4.B
N$228: R359.1 R360.2 VT4.C
N$229: VT3.E Z44.3
N$230: R361.1 R363.1 VD214.C
N$231: L4.1 XS1.VBUS
N$233: C143.1 DA17.2(V+)
N$235: C145.1 DA17.6(V-)
N$236: DA17.8(R2IN) Z46.3
N$237: DA17.7(T2OUT) Z45.3
N$238: C146.2 DA17.3(C1-)
N$239: C146.1 DA17.1(C1+)
N$240: C147.1 DA17.4(C2+)
N$241: C147.2 DA17.5(C2-)
N$242: DA16.1(TXD) Z50.1
N$314: DA16.4(RXD) Z47.1
N$342: DA15.5(3.3V) Z44.1
N$343: R364.2 Z49.1
N$344: R363.2 Z48.1
N$345: DA15.4(D3) Z43.1
N$346: DA15.6(D4) Z42.1
TO_RS232: VD212.A2 XP12.4 Z45.1
USART_FROM_MCU: DA17.10(T2IN) ; also sheet 1
USART_TO_MCU: DA17.9(R2OUT) ; also sheet 1
USB_DISCOVERY: Z49.3 ; also sheet 1
USB_PRESENT: Z48.3 ; also sheet 1
USBDM: DA15.3(D2) ; also sheet 1
USBDP: DA15.1(D1) ; also sheet 1
Unconnected: DA17.11(T1IN) DA17.12(R1OUT) DA17.13(R1IN) DA17.14(T1OUT) XP12.5 XP12.6 XP12.7 XP12.8 XS1.ID XS1.SHIELD1 XS1.SHIELD2 XS1.SHIELD3 XS1.SHIELD4

### Buses
TACHOMETER,FREQMETER,SPEEDOMETER,USB_DISCOVERY,USB_PRESENT,USBDP,USBDM,USART_FROM_MCU,USART_TO_MCU,CAN_TX,CAN_RX,+3V3_DIRT

### Notes on the sheet
- C(3)

## Sheet 11 of 11: hidden devices
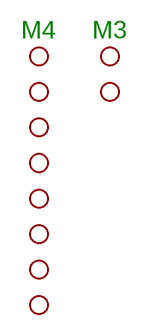
[diagram p10: schematic, sheet 11]

### Parts
JP1  STAND-OFF-M4  [STAND-OFF-M4]
JP2  STAND-OFF-M4  [STAND-OFF-M4]
JP3  STAND-OFF-M4  [STAND-OFF-M4]
JP4  STAND-OFF-M4  [STAND-OFF-M4]
JP5  STAND-OFF-M4  [STAND-OFF-M4]
JP6  STAND-OFF-M4  [STAND-OFF-M4]
JP7  STAND-OFF-M4  [STAND-OFF-M4]
JP8  STAND-OFF-M4  [STAND-OFF-M4]
JP9  STAND-OFF-M3  [STAND-OFF-M3]
JP10  STAND-OFF-M3  [STAND-OFF-M3]

### Notes on the sheet
- M4 | M3

## Library data of the parts
C1 C2 C6 C8-C11 C28-C42 C50 C52-C55 C59 C61 C63 C69-C147 = rcl:C-EU: CAPACITOR, European symbol; PARTNO: C0603C104K5RACTU
C3 C4 = rcl:C-EU: CAPACITOR, European symbol; PARTNO: C0603C220J5GACTU
C5 C64 C68 = rcl:CPOL-EU: POLARIZED CAPACITOR, European symbol; PARTNO: T491A106K010AT
C7 C12-C27 C65 = rcl:C-EU: CAPACITOR, European symbol; PARTNO: C0603C105K4PACTU
C43-C48 = rcl:C-EU: CAPACITOR, European symbol; PARTNO: C0603C102K5RACTU
C49 C51 = rcl:C-EU: CAPACITOR, European symbol; PARTNO: C0603C562K5RACTU
C56 C58 C60 = rcl:C-EU: CAPACITOR, European symbol; PARTNO: 22205C106KAT2A
C57 = rcl:CPOL-EU: POLARIZED CAPACITOR, European symbol; PARTNO: 516D108M050QS6AE3
C62 = rcl:C-EU: CAPACITOR, European symbol; PARTNO: C0603C103K5RACTU
C66 C67 = rcl:CPOL-EU: POLARIZED CAPACITOR, European symbol; PARTNO: T491D227K010AT
D1-D4 D6-D19 = optocoupler:TCMT4100; PARTNO: TCMT4100
D5 D20-D27 = transistor-fet:AUIPS7111S; PARTNO: AUIPS7111S
DA1-DA3 = op-amp:LM2904M: Low Power Dual Operational Amplifier; PARTNO: LM2904M
DA4-DA6 = op-amp:IL311A: Intergal clone of LM311 comparator.; PARTNO: IL311AD
DA7-DA9 = 74xx:74*123: Retriggerable monostable MULTIVIBRATOR; PARTNO: IN74HC123AD
DA10 = timer:*555: TIMER; PARTNO: SA555D
DA11 = driver-fet:MC33091A; PARTNO: IL33091AD
DA12 DA13 = vreg:LM2596?-*: SIMPLE SWITCHER 150 kHz, 3A Step-Down Voltage Regulator; PARTNO: LM2596S-5.0/NOPB
DA14 = vreg:IL52*; PARTNO: IL5233G
DA15 = usb:USBUF01W6: USB upstream EMI/ESD protection; PARTNO: USBUF01W6
DA16 = transceiver:SN65HVD232: CAN TRANSCEIVER; PARTNO: SN65HVD232D
DA17 = transceiver:ILX3232: RS232 TRANSCEIVER Integral clone; PARTNO: ILX3232D
DD1 = mcu:STM32F103VDT6; PARTNO: STM32F103VDT6
DD2 = rom:IN24*: Serial I2C EEPROM . Integral clone.; PARTNO: IN24AA32AD
DD3 = 74xx:74*11: Triple 3-input AND gate; PARTNO: IN74HC11AD
DD4-DD11 = 74xx:74*165: 8-bit parallel load SHIFT REGISTER; PARTNO: IN74HC165AD
DD12 = 74xx:74*595: 8-bit SHIFT REGISTER, output latch; PARTNO: IN74HC595AD
JP1-JP10 = mount:STAND-OFF-*: Stand Off This is the mechanical footprint for a #4 phillips button head screw. Use the keepout ring to avoid running the screw head into surrounding components. SKU : PRT-00447; BOM: EXCLUDE
L1 L4 = ferrite:EXC3BP: Chip Bead Core; PARTNO: EXC3BP121H
L2 = inductor-cooper:DRA127: POWER INDUCTOR; PARTNO: DR127-470-R
L3 = inductor-cooper:DRA73: POWER INDUCTOR; PARTNO: DR73-101-R
R1-R9 R42-R49 R66-R73 R87-R90 R92-R95 R97-R100 R170-R185 R188 R221-R236 R269-R284 R317-R333 R359 R361 = rcl:R-EU_: RESISTOR, European symbol; PARTNO: RC0603FR-1010KL
R10 = rcl:R-EU_: RESISTOR, European symbol; PARTNO: ERJ6GEY0R00V
R11 R12 R34-R41 R58-R65 R83-R85 R126 R127 R130 = rcl:R-EU_: RESISTOR, European symbol; PARTNO: RC0603FR-13100KL
R13 R14 R20 R136 R137 = rcl:R-EU_: RESISTOR, European symbol; PARTNO: ERJ3GEYJ331V
R15 R25 R134 R186 R187 R342-R357 R363 R364 = rcl:R-EU_: RESISTOR, European symbol; PARTNO: ERJ6GEYJ102V
R16-R19 R21-R24 R334-R341 = rcl:R-EU_: RESISTOR, European symbol; PARTNO: ERJ3GEYJ101V
R26-R33 R50-R57 = rcl:R-EU_: RESISTOR, European symbol; PARTNO: RC2512FK-071KL
R74-R76 R101-R106 R113-R115 = rcl:R-EU_: RESISTOR, European symbol; PARTNO: RC0603JR-071K2L
R77-R82 = rcl:R-EU_: RESISTOR, European symbol; PARTNO: RC0603FR-075K1L
R86 R91 R96 = rcl:R-EU_: RESISTOR, European symbol; PARTNO: RC0603JR-072K2L
R107-R112 = rcl:R-EU_: RESISTOR, European symbol; PARTNO: RC0603JR-0722KL
R116 = rcl:R-TRIMM: Trimm resistor; PARTNO: TSM4YJ102KR05
R117-R123 = rcl:R-EU_: RESISTOR, European symbol; PARTNO: RC0603JR-0751KL
R124 R125 R154-R169 R205-R220 R253-R268 R301-R316 = rcl:R-EU_: RESISTOR, European symbol; PARTNO: RC2512JK-071KL
R128 R129 R360 = rcl:R-EU_: RESISTOR, European symbol; PARTNO: ERJ3GEYJ363V
R131 = rcl:R-EU_: RESISTOR, European symbol; PARTNO: ERJ6GEYJ153V
R132 = rcl:R-EU_: RESISTOR, European symbol; PARTNO: RC0805JR-0782KL
R133 = rcl:R-EU_: RESISTOR, European symbol; PARTNO: ERJ6GEYJ474V
R135 = rcl:R-EU_: RESISTOR, European symbol; PARTNO: 35203K3JT
R138-R153 R189-R204 R237-R252 R285-R300 = rcl:R-EU_: RESISTOR, European symbol; PARTNO: RC1206JR-074K7L
R358 = rcl:R-EU_: RESISTOR, European symbol; PARTNO: RC1206JR-07120RL
R362 = rcl:R-EU_: RESISTOR, European symbol; PARTNO: ERJ3GEYJ473V
RK1 RK3 = fuse:RESETTABLE_FUSE_; PARTNO: 1210L050YR
RK2 = fuse:RESETTABLE_FUSE_; PARTNO: 1812L200DR
SB1 = switch:4-1437565-2: SMD Tactile Switch Manufacturer TE CONNECTIVITY; LABEL: RESET; PARTNO: 4-1437565-2
VD1 VD2 = led:LED: LEDs SMD Leds; PARTNO: KPHCM-2012EC-T
VD3 = led:LED: LEDs SMD Leds; PARTNO: KPHCM-2012SGC-T
VD4-VD11 VD20-VD27 VD48 VD49 VD53 VD54 VD57 VD62 VD212 VD213 = diode:DIODE-TVS-BIDIR-; PARTNO: SMBJ24CA
VD12-VD19 VD28-VD35 = diode:DIODE-SCHOTTKY-: SCHOTTKY DIODE; PARTNO: BAT54JFILM
VD36-VD47 VD50-VD52 VD214 = diode:DIODE-ZENER-; PARTNO: BZV55-C3V3
VD55 = diode:DIODE-TVS-UNIDIR-; PARTNO: SM6T6V8A
VD56 VD60 VD82-VD97 VD116-VD131 VD148-VD163 VD180-VD195 = diode:DIODE-STANDARD-; PARTNO: S1G-E3/61T
VD58 = diode:DIODE-SCHOTTKY-: SCHOTTKY DIODE; PARTNO: VS-30BQ060TRPBF
VD59 = diode:DIODE-SCHOTTKY-: SCHOTTKY DIODE; PARTNO: VS-10BQ060TRPBF
VD61 = diode:IDD06SG60C; PARTNO: IDD06SG60C
VD63 VD66-VD81 VD100-VD115 VD132-VD147 VD164-VD179 = diode:DIODE-TVS-UNIDIR-; PARTNO: SM6T200A
VD64 = led:LED: LEDs SMD Leds; LABEL: +5V; PARTNO: KPHCM-2012SGC-T
VD65 = led:LED: LEDs SMD Leds; LABEL: -5V; PARTNO: KPHCM-2012SGC-T
VD98 VD99 VD196-VD211 = diode:DIODE-STANDARD-; PARTNO: 1N4148WS-V-GS18
VT1 = transistor-fet:IRFR430: N-Channel HEXFET; PARTNO: IRFR430APBF
VT2-VT4 = transistor-npn:BC817*: NPN Transistor; PARTNO: BC817
XP1 = connector:PLD_2X10: Standard 10x2 JTAG header for ARM.; LABEL: JTAG; PARTNO: MC9A12-2034
XP2 = connector:PLD_1X03; LABEL: BOOT_1; PARTNO: 825433-3
XP3 = connector:PLD_1X03; LABEL: BOOT_0; PARTNO: 825433-3
XP4 = connector:MOLEX-90130-*16; LABEL: ANALOG; PARTNO: 90130-1216
XP5 = connector:MOLEX-90130-*08; LABEL: FREQUENCY; PARTNO: 90130-1208
XP6 = connector:MOLEX-90130-*08; LABEL: POWER; PARTNO: 90130-1208
XP7 = connector:MOLEX-90130-*16; LABEL: DISCRETE(1..16); PARTNO: 90130-1216
XP8 = connector:MOLEX-90130-*16; LABEL: DISCRETE(17..32); PARTNO: 90130-1216
XP9 = connector:MOLEX-90130-*16; LABEL: DISCRETE(33..48); PARTNO: 90130-1216
XP10 = connector:MOLEX-90130-*16; LABEL: DISCRETE(47..64); PARTNO: 90130-1216
XP11 = connector:MOLEX-90130-*34; LABEL: OUTPUTS; PARTNO: 90130-1234
XP12 = connector:MOLEX-90130-*08; LABEL: INTERFACES; PARTNO: 90130-1208
XP13 = connector:PLD_1X02; PARTNO: 825433-2
XS1 = usb:USB-MINIB_(SOVOK-UGO); PARTNO: MUBS1-05SN2
Z1-Z40 Z42-Z50 = emi-filter:NFE31PT; PARTNO: NFE31PT152Z1E9
Z41 = emi-filter:4701-*; PARTNO: 4701-001LF
ZQ1 = crystal:CRYSTAL: Crystals Various standard crystals. Proven footprints. Spark Fun Electronics SKU : COM-00534; PARTNO: CA-4.000-18-3050-X